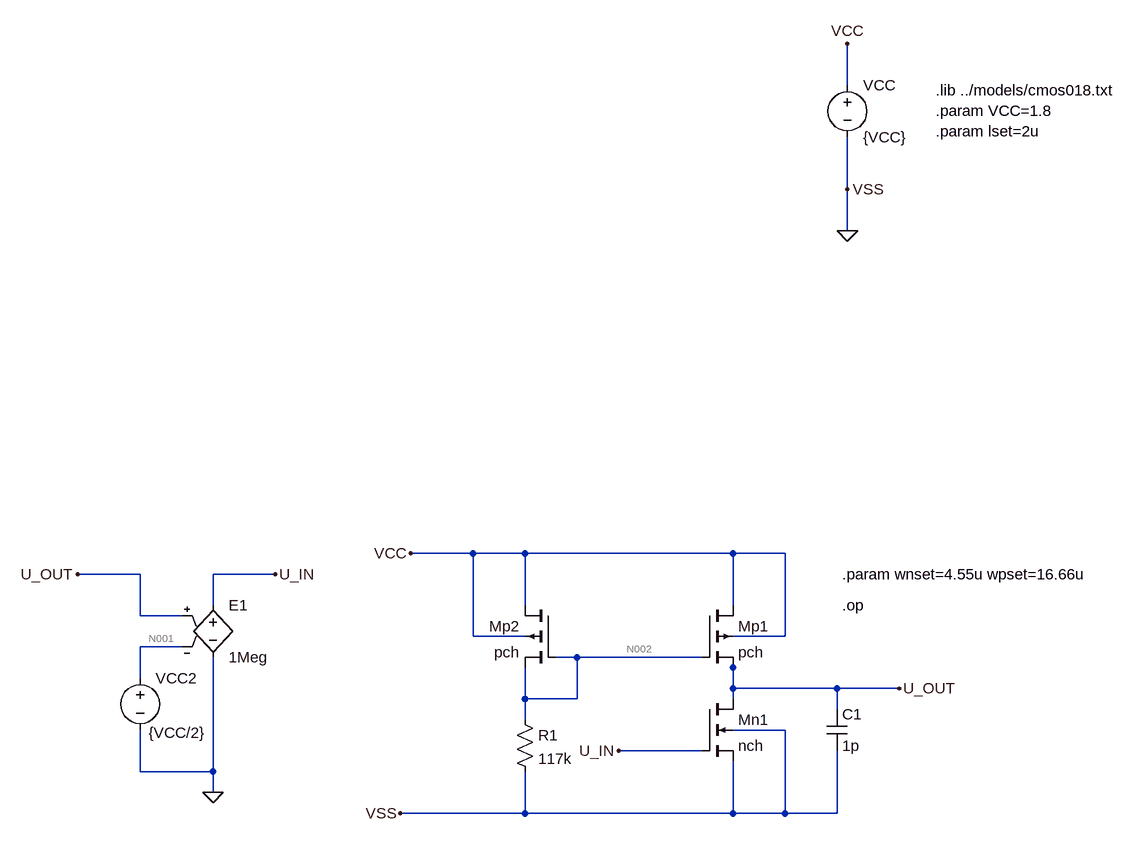
[diagram p0: schematic 4-2-1.asc]
4-2-1.asc, the LTspice schematic file:
Version 4
SHEET 1 7274800 2004
WIRE 1072 -544 1072 -608
WIRE 1072 -384 1072 -464
WIRE 1072 -320 1072 -384
WIRE 496 176 400 176
WIRE 576 176 496 176
WIRE 896 176 576 176
WIRE 976 176 896 176
WIRE -16 208 -112 208
WIRE 192 208 96 208
WIRE 96 256 96 208
WIRE 576 256 576 176
WIRE 896 256 896 176
WIRE -16 272 -16 208
WIRE 48 272 -16 272
WIRE 496 304 496 176
WIRE 576 304 496 304
WIRE 976 304 976 176
WIRE 976 304 896 304
WIRE 48 320 -16 320
WIRE 656 336 624 336
WIRE 848 336 656 336
WIRE 896 352 896 336
WIRE -16 368 -16 320
WIRE 896 384 896 352
WIRE 1056 384 896 384
WIRE 1152 384 1056 384
WIRE 576 400 576 352
WIRE 656 400 656 336
WIRE 656 400 576 400
WIRE 896 400 896 384
WIRE 1056 416 1056 384
WIRE 576 432 576 400
WIRE 976 448 896 448
WIRE 848 480 720 480
WIRE -16 512 -16 448
WIRE 96 512 96 336
WIRE 96 512 -16 512
WIRE 96 544 96 512
WIRE 576 576 576 512
WIRE 576 576 384 576
WIRE 896 576 896 496
WIRE 896 576 576 576
WIRE 976 576 976 448
WIRE 976 576 896 576
WIRE 1056 576 1056 480
WIRE 1056 576 976 576
FLAG 1072 -320 0
FLAG 1072 -608 VCC
FLAG 400 176 VCC
FLAG 384 576 VSS
FLAG 1072 -384 VSS
FLAG 1152 384 U_OUT
FLAG 720 480 U_IN
FLAG 192 208 U_IN
FLAG 96 544 0
FLAG -112 208 U_OUT
DATAFLAG 1056 384 ""
DATAFLAG 720 176 ""
DATAFLAG 736 336 ""
DATAFLAG 800 480 ""
DATAFLAG 928 240 "Id(Mn1)"
SYMBOL voltage 1072 -560 R0
WINDOW 123 0 0 Left 0
WINDOW 39 0 0 Left 0
SYMATTR InstName VCC
SYMATTR Value {VCC}
SYMBOL nmos4 848 400 R0
SYMATTR InstName Mn1
SYMATTR Value nch
SYMATTR Value2 l=lset w=wnset
SYMBOL res 560 416 R0
SYMATTR InstName R1
SYMATTR Value 117k
SYMBOL cap 1040 416 R0
SYMATTR InstName C1
SYMATTR Value 1p
SYMBOL voltage -16 352 R0
WINDOW 39 0 0 Left 0
WINDOW 3 13 100 Left 2
SYMATTR Value {VCC/2}
SYMATTR InstName VCC2
SYMBOL pmos4 848 256 R0
SYMATTR InstName Mp1
SYMATTR Value pch
SYMATTR Value2 l=lset w=wpset
SYMBOL pmos4 624 256 M0
SYMATTR InstName Mp2
SYMATTR Value pch
SYMATTR Value2 l=lset w=wpset
SYMBOL e 96 240 R0
SYMATTR InstName E1
SYMATTR Value 1Meg
TEXT 1208 -536 Left 2 !.lib ../models/cmos018.txt\n.param VCC=1.8\n.param lset=2u
TEXT 1064 208 Left 2 !.param wnset=4.55u wpset=16.66u
TEXT 1064 256 Left 2 !.op

The netlist it stands for:
* 4-2-1.asc
VCC VCC 0 {VCC}
Mn1 U_OUT U_IN 0 0 nch l=lset w=wnset
R1 N002 0 117k
C1 U_OUT 0 1p
VCC2 N001 0 {VCC/2}
Mp1 VCC N002 U_OUT VCC pch l=lset w=wpset
Mp2 VCC N002 N002 VCC pch l=lset w=wpset
E1 U_IN 0 U_OUT N001 1Meg
.model NMOS NMOS
.model PMOS PMOS
.lib standard.mos
.lib ../models/cmos018.txt
.param VCC=1.8
.param lset=2u
.param wnset=4.55u wpset=16.66u
.op
.backanno
.end

* Results of the author's LTspice run, read from the files saved beside the schematic
* Operating Point:
*   V(vcc) = 1.8 V
*   V(u_out) = 900 mV
*   V(u_in) = 592.5 mV
*   V(n002) = 1.19 V
*   V(n001) = 900 mV
*   Id(Mn1) = 10.4 µA
*   Ig(Mn1) = 0 A
*   Ib(Mn1) = -910 fA
*   Is(Mn1) = -10.4 µA
*   Id(Mp1) = 10.4 µA
*   Ig(Mp1) = 0 A
*   Ib(Mp1) = 910 fA
*   Is(Mp1) = -10.4 µA
*   Id(Mp2) = 10.17 µA
*   Ig(Mp2) = 0 A
*   Ib(Mp2) = 620.4 fA
*   Is(Mp2) = -10.17 µA
*   I(C1) = 0 A
*   I(R1) = 10.17 µA
*   I(E1) = 0 A
*   I(Vcc) = -20.57 µA
*   I(Vcc2) = 0 A
* From the log:
*   Semiconductor Device Operating Points:
*                           --- BSIM3 MOSFETS ---
*   Name:        mn1         mp1         mp2
*   Model:       nch         pch         pch
*   Id:        1.04e-05    1.04e-05    1.02e-05
*   Vgs:       5.92e-01    2.90e-01    0.00e+00
*   Vds:       9.00e-01    9.00e-01    6.10e-01
*   Vbs:       0.00e+00    9.00e-01    6.10e-01
*   Vth:       3.82e-01   -4.03e-01   -4.04e-01
*   Vdsat:     1.63e-01   -1.73e-01   -1.72e-01
*   Gm:        1.02e-04    9.44e-05    9.29e-05
*   Gds:       4.60e-07    7.92e-07    8.00e-07
*   Gmb        1.09e-04    3.00e-05    2.95e-05
*   Cbd:       0.00e+00    0.00e+00    0.00e+00
*   Cbs:       0.00e+00    0.00e+00    0.00e+00
*   Cgsov:     3.19e-15    1.14e-14    1.14e-14
*   Cgdov:     3.17e-15    1.15e-14    1.15e-14
*   Cgbov:     1.98e-18    1.96e-18    1.96e-18
*   dQgdVgb:   6.84e-14    2.46e-13    2.46e-13
*   dQgdVdb:  -3.05e-15   -1.10e-14   -1.11e-14
*   dQgdVsb:  -9.66e-14   -2.25e-13   -2.25e-13
*   dQddVgb:  -2.83e-14   -1.03e-13   -1.03e-13
*   dQddVdb:   3.10e-15    1.12e-14    1.13e-14
*   dQddVsb:   5.35e-14    1.21e-13    1.21e-13
*   dQbdVgb:  -1.18e-14   -4.01e-14   -4.00e-14
*   dQbdVdb:   1.20e-17    4.74e-17   -1.56e-17
*   dQbdVsb:  -1.36e-14   -2.92e-14   -2.92e-14